# Altium project ground_receiver_board.PrjPcb
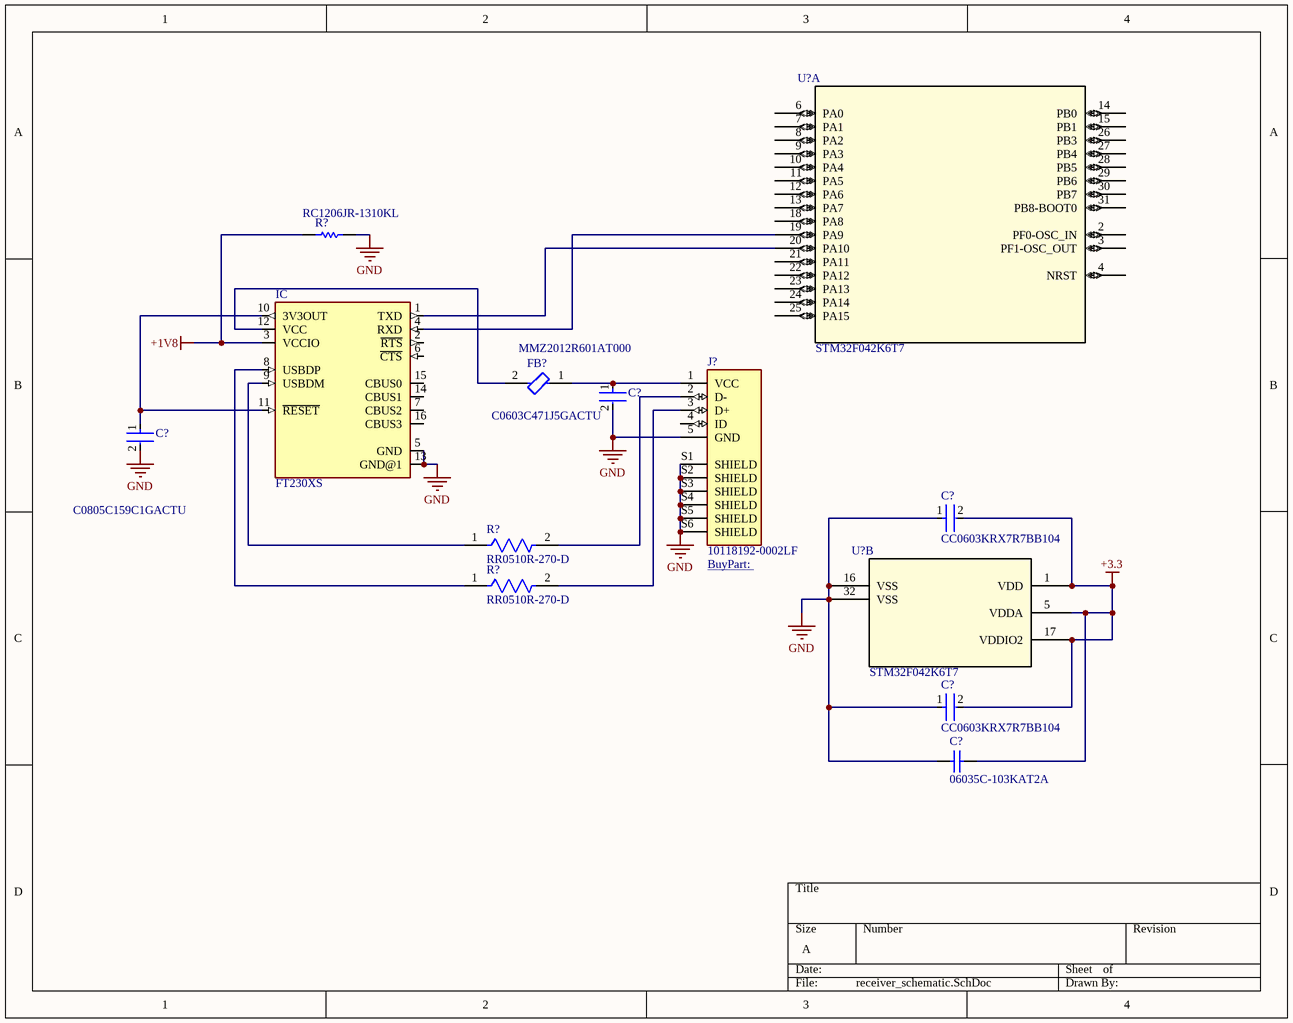
[diagram p0: receiver_schematic.SchDoc]
1 sheet, 13 parts. Net scope: global (net labels, ports and power ports of the same name join across sheets).

## Sheet receiver_schematic.SchDoc
size A

### Parts
(Parts that share a designator on the sheet are numbered #1, #2 ... from top to bottom, then left to right.)
C?#1  C0603C471J5GACTU  [FP-C0603C-CF-MFG]
C?#2  C0805C159C1GACTU  [FP-C0805C-DN-MFG]
C?#3  CC0603KRX7R7BB104  [FP-CC0603-DA-MFG]
C?#4  CC0603KRX7R7BB104  [FP-CC0603-DA-MFG]
C?#5  06035C-103KAT2A  [CAPC1608X90X35LL15T15]
FB?  MMZ2012R601AT000  [FP-MMZ2012-IPC_A]
IC  FT230XS  [SSOP16]
J?  10118192-0002LF  [AMPHENOL_10118192-0002LF]
R?#1  RC1206JR-1310KL  [RESC3116X65X40ML10T20]
R?#2  RR0510R-270-D  [FP-RR0510-IPC_C]
R?#3  RR0510R-270-D  [FP-RR0510-IPC_C]
U?#1  STM32F042K6T7  [LQFP-32]  (part A of 2)
U?#2  STM32F042K6T7  [LQFP-32]  (part B of 2)

### Nets
+1V8: IC.3(VCCIO) R?#1.1
+3.3: C?#3.2 C?#4.2 C?#5.2 U?#2.1(VDD) U?#2.5(VDDA) U?#2.17(VDDIO2)
GND: C?#1.2 C?#2.2 C?#3.1 C?#4.1 C?#5.1 IC.5(GND) IC.13(GND@1) J?.5(GND) J?.S1(SHIELD) J?.S2(SHIELD) J?.S3(SHIELD) J?.S4(SHIELD) J?.S5(SHIELD) J?.S6(SHIELD) R?#1.2 U?#2.16(VSS) U?#2.32(VSS)
NetC?#1_1: C?#1.1 FB?.1 J?.1(VCC)
NetC?#2_1: C?#2.1 IC.10(3V3OUT) IC.11(~{RESET})
NetFB?_2: FB?.2 IC.12(VCC)
NetIC_1: IC.1(TXD) U?#1.20(PA10)
NetIC_4: IC.4(RXD) U?#1.19(PA9)
NetIC_8: IC.8(USBDP) R?#3.1
NetIC_9: IC.9(USBDM) R?#2.1
NetJ?_2: J?.2(D-) R?#2.2
NetJ?_3: J?.3(D+) R?#3.2

Not connected (* = marked no-connect by the designer): IC 2(~{RTS}) 6(~{CTS}) 7(CBUS2) 14(CBUS1) 15(CBUS0) 16(CBUS3); J? 4(ID); U?#1 2(PF0-OSC_IN) 3(PF1-OSC_OUT) 4(NRST) 6(PA0) 7(PA1) 8(PA2) 9(PA3) 10(PA4) 11(PA5) 12(PA6) 13(PA7) 14(PB0) 15(PB1) 18(PA8) 21(PA11) 22(PA12) 23(PA13) 24(PA14) 25(PA15) 26(PB3) 27(PB4) 28(PB5) 29(PB6) 30(PB7) 31(PB8-BOOT0)

### Library data of the parts
C?#1 = CMP-2006-03581-2: CAP CER 470PF 50V 5% NP0 0603; Manufacturer: KEMET; Tolerance: 0.05; Temperature Coefficient: 30ppm/°C; Temperature Characteristic: C0G; Automotive Grade: Grade 1; Material: Ceramic; Description: C0603 470 pF C0G 30ppm/°C 5.00% 50 V; Digikey Description: CAP CER 470PF 50V 5% NP0 0603; Device Class L2: Capacitors; Capacitance: 470 pF; Device Class L3: Ceramic Capacitors; RoHS: TRUE; Voltage Rating: 50 V; Height: 0.87mm; Value: 470 pF; Temperature Range Low: -55°C; Temperature Range High: +125°C; Package: C0603C-CF; Octopart: https://octopart.com/c0603c471j5gactu-kemet-95298; Temperature: -55°C to +125°C; Automotive: Yes; Lead Free: Yes; Manufacturer Part Number: C0603C471J5GACTU; ComponentLink2Description: Datasheet; Mouser Description: Ceramic Capacitor 470Pf 50V, C0G, 5%, 0603, Full Reel; Category: Cap; ComponentLink2URL: https://api.kemet.com/component-edge/download/datasheet/C0603C100J5GACAUTO.pdf; Device Class L1: Passive Components
C?#2 = CMP-03020-023253-1: CAP CER 1.5PF 100V NP0 0805; Manufacturer: KEMET; Temperature Coefficient: 30ppm/°C; Temperature Characteristic: C0G; Description: C0805 1.5 pF C0G 30ppm/°C 0.25 pF 100 V; Material: Ceramic; Tolerance: 0.25 pF; Temperature Range High: +125°C; RoHS: TRUE; Mouser Description: Multilayer Ceramic Capacitors MLCC - SMD/SMT 100volts 1.5pF C0G 0.25%; Temperature Range Low: -55°C; Device Class L3: Ceramic Capacitors; Device Class L1: Passive Components; Manufacturer Part Number: C0805C159C1GACTU; Octopart: https://octopart.com/c0805c159c1gactu-kemet-8375762; Automotive: No; Temperature: -55°C to +125°C; Digikey Description: CAP CER 1.5PF 100V NP0 0805; Capacitance: 1.5 pF; Voltage Rating: 100 V; Category: Cap; Device Class L2: Capacitors; Package: C0805C-DN; ComponentLink2Description: Datasheet; Lead Free: Yes; ComponentLink2URL: https://content.kemet.com/datasheets/KEM_C1003_C0G_SMD.pdf; Value: 1.5 pF; Ipc Land Pattern Name: CAPC200125X78; Height: 0.88mm
C?#3 C?#4 = CMP-2000-05002-2: CAP CER 0.1UF 16V X7R 0603; Manufacturer: YAGEO; Tolerance: 0.1; Value: 100 nF; Temperature Coefficient: 15%; Material: Ceramic; Voltage Rating: 16 V; Package: CC0603-DA; ComponentLink2Description: Datasheet; Octopart: https://octopart.com/cc0603krx7r7bb104-yageo-192941; Temperature Range High: +125°C; Digikey Description: CAP CER 0.1UF 16V X7R 0603; Voltage: 16 V; Device Class L2: Capacitors; Height: 0.9mm; Temperature: -55°C to +125°C; Manufacturer Part Number: CC0603KRX7R7BB104; Device Class L1: Passive Components; Device Class L3: Ceramic Capacitors; ComponentLink2URL: http://www.yageo.com/documents/recent/UPY-GPHC_X7R_6.3V-to-50V_18.pdf; Footprint Url: http://www.yageo.com/exep/pages/download/literatures/UPY-C_GEN_24.pdf; RoHS: TRUE; Temperature Range Low: -55°C; Temperature Characteristic: X7R; Lead Free: Yes; Capacitance: 100 nF; Category: Cap; Mouser Description: Multilayer Ceramic Capacitor, CC Series, 0.1 - F, - 10%, X7R, 16 V, 0603 [1608 Metric]; Automotive: No
C?#5 = CMP-2006-04374-1: Manufacturer: AVX Interconnect / Elco; Part Number: 06035C-103KAT2A
FB? = CMP-08257-000163-1: Signal Line Ferrite Bead 600Ω @ 100Mhz 500mA DCR 200mΩ SMD 0805; DC Resistance (DCR): 200mR; Tolerance: 25%; Impedance: 600R; Case/Package: 0805; Max DC Current: 500mA; RoHS Compliant: Yes; Mount: Surface Mount; Current Rating: 500mA; Case Code (Metric): 2012; Number of Pins: 2; Package Quantity: 1; Series: MMZ; Packaging: Cut Tape; Depth: 1.25mm; Width: 0.049inch; Length: 0.079inch; Case Code (Imperial): 0805; Height: 0.041inch; Core Material: Ferrite; REACH SVHC: No SVHC
IC = FT230XS: USB Bridge, USB to UART USB 2.0 UART Interface 16-SSOP; MF: FTDI, Future; MP: FT230XS; Price: None; Availability: Unavailable; Package: SSOP-16 FTDI; SnapEDA_Link: https://www.snapeda.com/parts/FT230XS/FTDI%2C%20Future%20Technology%20Devices%20International%20Ltd/view-part/433817/?ref=snap; Value: *
J? = 10118192-0002LF: USB - micro B USB 2.0 Receptacle Connector 5 Position Surface Mount, Right Angle; MF: Amphenol ICC; MP: 10118192-0002LF; SnapEDA_Link: https://www.snapeda.com/parts/10118192-0002LF/Amphenol%20FCI/view-part/551616/?ref=snap; Price: None; Mouser-Purchase-URL: https://snapeda.com/shop?store=Mouser&id=551616; Availability: Good; DigiKey-Purchase-URL: https://snapeda.com/shop?store=DigiKey&id=551616; Package: None; Value: *; Arrow_Electronics-Purchase-URL: https://snapeda.com/shop?store=Arrow+Electronics&id=551616
R?#1 = CMP-2003-04020-1: Manufacturer: Yageo; Part Number: RC1206JR-1310KL
R?#2 R?#3 = CMP-2002-01667-2: 27Ω ±0.5% 0.0625W 1/16W Chip Resistor 0402 (1005 Metric) Thin Film; Max Power Dissipation: 63mW; Voltage Rating (DC): 25V; Resistance: 27R; Temperature Coefficient: 100ppm/°C; Power Rating: 62.5mW; Series: RR; Resistor Type: Thin Film; Case Code (Metric): 1005; RoHS Compliant: Yes; Weight: 2.3E-05oz; Packaging: Tape and Reel; Length: 0.039inch; Tolerance: 0.5%; Min Operating Temperature: -55°C; Case/Package: 0402; Height: 0.016inch; Voltage Rating: 25V; Lead Free: Lead Free; Size Code: 0402; Termination: SMD/SMT; Max Operating Temperature: 125°C; Number of Pins: 2; Width: 0.5mm; Number of Terminations: 2; Package Quantity: 1; Case Code (Imperial): 0402
U?#1 U?#2 = STM32F042K6T7: No Description Available; Vendor: STMicroelectronics; Built_By: EMA_UL_Team; SourceLibrary: Updates_to_database_2020-10-19; Manufacturer_Part_Number: STM32F042K6T7; Copyright: Copyright (C) 2018 Accelerated Designs. All rights reserved; RefDes: RefDes; Type: DEV